# EAGLE design Adafruit VL53L0X (EAGLE 6.6.0)
COMPANY: ADAFRUIT INDUSTRIES; DRAWN: KTOWN; REV: A
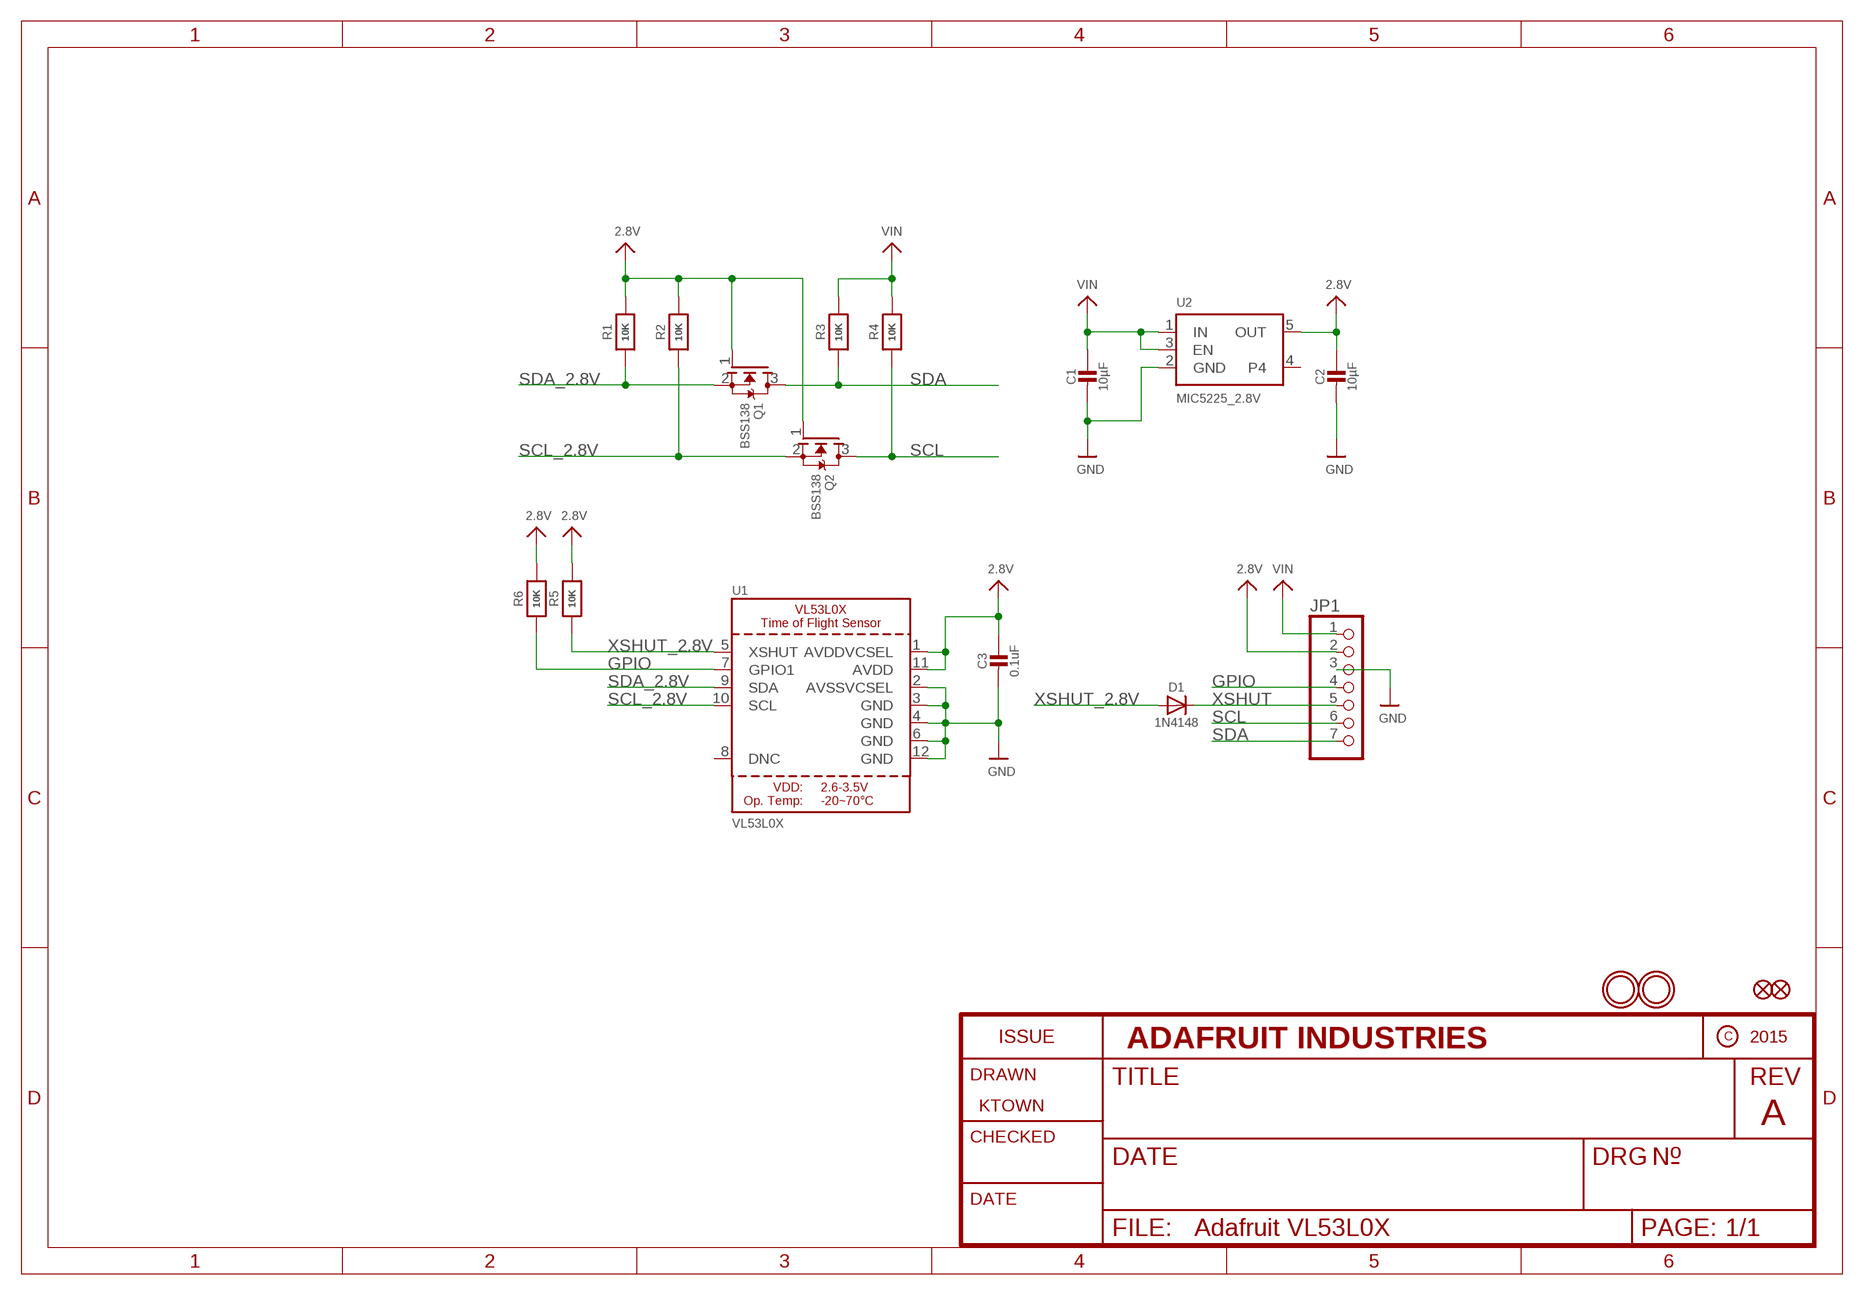
[diagram p0: schematic, sheet 1]

## Parts
C1  10µF  CAP_CERAMIC0805-NOOUTLINE  [0805-NO]
C2  10µF  CAP_CERAMIC0805-NOOUTLINE  [0805-NO]
C3  0.1uF  CAP_CERAMIC0805-NOOUTLINE  [0805-NO]
D1  1N4148  DIODESOD-323  [SOD-323]
FID2  FIDUCIAL""  [FIDUCIAL_1MM]
FID3  FIDUCIAL""  [FIDUCIAL_1MM]
JP1  HEADER-1X770MIL  [1X07_ROUND_70]
Q1  BSS138  MOSFET-NWIDE  [SOT23-WIDE]
Q2  BSS138  MOSFET-NWIDE  [SOT23-WIDE]
R1  10K  RESISTOR0805_NOOUTLINE  [0805-NO]
R2  10K  RESISTOR0805_NOOUTLINE  [0805-NO]
R3  10K  RESISTOR0805_NOOUTLINE  [0805-NO]
R4  10K  RESISTOR0805_NOOUTLINE  [0805-NO]
R5  10K  RESISTOR0805_NOOUTLINE  [0805-NO]
R6  10K  RESISTOR0805_NOOUTLINE  [0805-NO]
U1  VL53L0X  [LGA12_ST]
U2  MIC5225_2.8V  VREG_SOT23-5  [SOT23-5]
U$13  MOUNTINGHOLE2.5  [MOUNTINGHOLE_2.5_PLATED]
U$14  MOUNTINGHOLE2.5  [MOUNTINGHOLE_2.5_PLATED]

## Nets
2.8V: C2.1 C3.1 JP1.2 Q1.1(G) Q2.1(G) R1.2 R2.2 R5.2 R6.2 U1.1(AVDDVCSEL) U1.11(AVDD) U2.5(OUT)
GND: C1.2 C2.2 C3.2 JP1.3 U1.2(AVSSVCSEL) U1.3(GND) U1.4(GND) U1.6(GND) U1.12(GND) U2.2(GND)
GPIO: JP1.4 R6.1 U1.7(GPIO1)
SCL: JP1.6 Q2.3(D) R4.1
SCL_2.8V: Q2.2(S) R2.1 U1.10(SCL)
SDA: JP1.7 Q1.3(D) R3.1
SDA_2.8V: Q1.2(S) R1.1 U1.9(SDA)
VIN: C1.1 JP1.1 R3.2 R4.2 U2.1(IN) U2.3(EN)
XSHUT: D1.C JP1.5
XSHUT_2.8V: D1.A R5.1 U1.5(XSHUT)
Unconnected: U1.8(DNC) U2.4

## Library data of the parts
C1-C3 = microbuilder:CAP_CERAMIC: Ceramic Capacitors For new designs, use the packages preceded by an '_' character since they are more reliable: The following footprints should be used on most boards: _0402 - Standard footprint for regular board layouts _0603 - Standard footprint for regular board layouts _0805 - Standard footprint for regular board layouts _1206 - Standard footprint for regular board layouts For extremely tight-pitch boards where space is at a premium, the following 'micro-pitch' footprints can be used (smaller pads, no silkscreen outline, etc.): _0402MP - Micro-pitch footprint for very dense/compact boards _0603MP - Micro-pitch footprint for very dense/compact boards _0805MP - Micro-pitch footprint for very dense/compact boards _1206MP - Micro-pitch footprint for very dense/compact boards
D1 = microbuilder:DIODE: Diode SMA Model Volts Amps Type Vf Ir Digikey # Notes SSA34-E3 40V 3A Schottky 480mV @ 3A 200uA @ 40V SSA34-E3/61TGITR-ND CDBA120-G 20V 1A Schottky 500mV @ 1A 500uA @ 20V 641-1014-6-ND REEL MBRA210 10V 2A Schottky 350mV @ 2A 700uA @ 10V MBRA210LT3 SOD-123 Model Volts Amps Type Vf Ir Order # Notes BAT54T1G 30V 200mA Schottky 800mV @ 200mA 2uA @ 25V BAT54T1GOSTR-ND B0530W 30V 500mA Schottky 430mV @ 500mA 130uA @ 30V B0530W-FDICT-ND REEL MBR120 20V 1A Schottky 340mV @ 1A MBR120VLSFT1GOSCT-ND SOD-323 Model Volts Amps Type Vf Ir Order # Notes PMEG2005EJ 20V 500mA Schottky 355mV @ 500mA 568-4110-1-ND ZLLS410 10V 570mA Schottky 380mV @ 570mA ZLLS410CT-ND 1N4148WS 75V 150mA Silicon/Simple 1V 1N4148WSFSCT-ND REEL SOD-523 Model Volts Amps Type Vf Ir Order # Notes BAT54XV2 30V 200mA Schottky 0.8V @ 100mA BAT54XV2CT-ND TB751S 30V 30mA Schottky RB751S-40TE61CT-ND SOT23-R/W (R = Solder Paste/Reflow Ovens, W = Hand-Soldering) Model Volts Amps Type Vf Ir Order # Notes BAT54FILM 40V 300mA Schottky 497-7162-1-ND POWERDI-5 Model Volts Amps Type Vf Ir Order # Notes PDS560 60V 5A Schottky 670mV @ 5A 150uA @ 60V PDS560DICT-ND
FID2 FID3 = microbuilder:FIDUCIAL: Fiducial Alignment Points Various fiducial points for machine vision alignment.; BOM: EXCLUDE
JP1 = microbuilder:HEADER-1X7: PIN HEADER
Q1 Q2 = microbuilder:MOSFET-N: N-Channel Mosfet LEGEND VDS: Voltage Drain-Source ID: Drain Current RDS(ON): Drain-Source On-State Resistance VGS(TH): Gate-Source Threshold Voltage CISS: Drain-Source Input Capacitance SOT-23 Name VDS ID RDS(ON) VGS(TH) CISS Order Number 2N7002E 60V 260mA 2.5 Ohm 2.5V @ 250uA 26.7pF @ 25V 2N7002ET1GOSTR-ND BSH103 30V 850mA 400 mOhm 400mV @ 1mA 83pF @ 24V BSH103,235-ND BSS138 60V 320mA 1.6 Ohm 1.5V @ 250uA 50pF @ 10V Mouser: 771-BSS138PW115 DMN2075U-7 20V 4.2A 38 mOhm 1V @ 250 uA 594.3pF @ 10V DMN2075U-7DICT-ND * BSS138 good choice for I2C level-shifting POWERPAK 1212-8 Name VDS ID RDS(ON) VGS(TH) CISS Order Number Si7308DN 60V 6A 58 mOhm 3V @ 250uA 665pF @ 15V SI7308DN-T1-E3CT-ND
R1-R6 = microbuilder:RESISTOR: Resistors For new designs, use the packages preceded by an '_' character since they are more reliable: The following footprints should be used on most boards: _0402 - Standard footprint for regular board layouts _0603 - Standard footprint for regular board layouts _0805 - Standard footprint for regular board layouts _1206 - Standard footprint for regular board layouts For extremely tight-pitch boards where space is at a premium, the following 'micro-pitch' footprints can be used (smaller pads, no silkscreen outline, etc.): _0402MP - Micro-pitch footprint for very dense/compact boards _0603MP - Micro-pitch footprint for very dense/compact boards _0805MP - Micro-pitch footprint for very dense/compact boards _1206MP - Micro-pitch footprint for very dense/compact boards
U1 = microbuilder:VL53L0X: VL53L0X - Laser Time of Flight Sensor (2M range)
U2 = microbuilder:VREG_SOT23-5: SOT23-5 Fixed Voltage Regulators Part Current Out V Out V In V Dropout θJA (°C/W) TJ (°C) Digikey Part No. ADP121 150mA 3.3V 3.4-5.5V 0.09V @ 150mA -- -- ADP121-AUJZ33R7CT-ND ADP121 150mA 3.0V 3.1-5.5V 0.09V @ 150mA -- -- ADP121-AUJZ30R7CT-ND ADP122 300mA 3.3V 3.4-5.5V 0.085V @ 300mA -- -- ADP122AUJZ-3.3-R7CT-ND ADP1712 300mA 3.3V 3.5-5.5V 0.17V @ 300mA -- -- ADP1712AUJZ-3.3-R7TR-ND AP7311 (Low Cost) 150mA 3.3V 3.5-6V 0.15V @ 150mA -- -- AP7311-33WG-7DICT-ND LD39015M18R 150mA 1.8V 1.9V-5.5V 0.08V @ 100mA -- -- 497-6977-1-ND LP2985A-33DBVR 150mA 3.3V 3.3-16V 0.28V @ 150mA 206 150 296-18479-1-ND MCP1824T-3302E/OT 300mA 3.3V 3.5V-6V 0.2V @ 300mA -- -- MCP1824T-3302E/OTCT-ND MIC5205-2.5YM5 TR 150mA 2.5V 2.7-16V 0.165V @ 150mA -- -- 576-1257-2-ND MIC5205-3.0YM5 TR 150mA 3.0V 3.2V-16V 0.165V @ 150mA -- -- 576-1258-2-ND MIC5205-3.3YM5 TR 150mA 3.3V 3.5V-16V 0.165V @ 150mA -- -- 576-1259-2-ND TPS780330220 150mA 3.3V+2.2V 3.6-5.5V 250mV Max -- -- 296-23332-1-ND TDA3663/N1,135 100mA 3.3V 3.5-45V 0.18V @ 50mA -- -- 568-5343-1-ND Max operating temp can be calculated using θJA, TJ (max junction temperature), and power in watts. Set the "Maximum Ambient Temperature" until it reaches TJ ("Max Junction Temperature"), which is the absolute limit for safe use of the regulator: Heat Sink Temperature Calculator <http://www.daycounter.com/Calculators/Heat-Sink-Temperature-Calculator.phtml> For example, With 12V source into a 3.3V LP2985 and a 30mA load, we are dissipating (12V-3.3V) * 0.03A = 0.261W. With a θJA of 206 °C/W, a TJ of 150°C, and 261mW we can safely use the chip without a heat sink up to 75°C (=147.1°C Junction Temperature).
U$13 U$14 = microbuilder:MOUNTINGHOLE: Mounting Hole For #2 screws (0.086"/2.18mm width, 0.094"/2.4mm hole) use 2.5mm; BOM: EXCLUDE

## Board
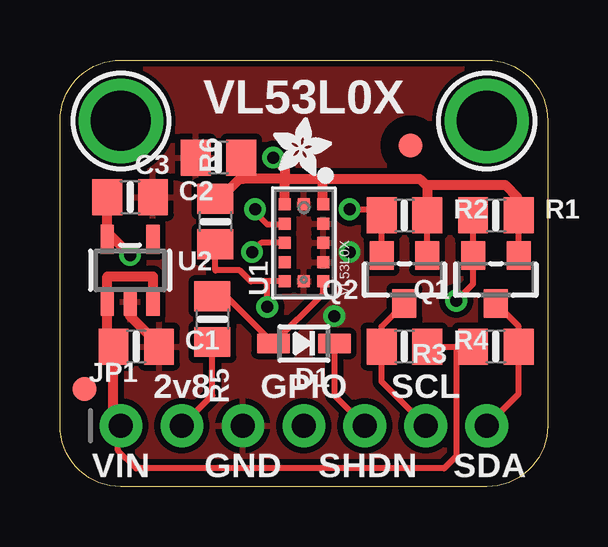
[diagram p1: board, top side]
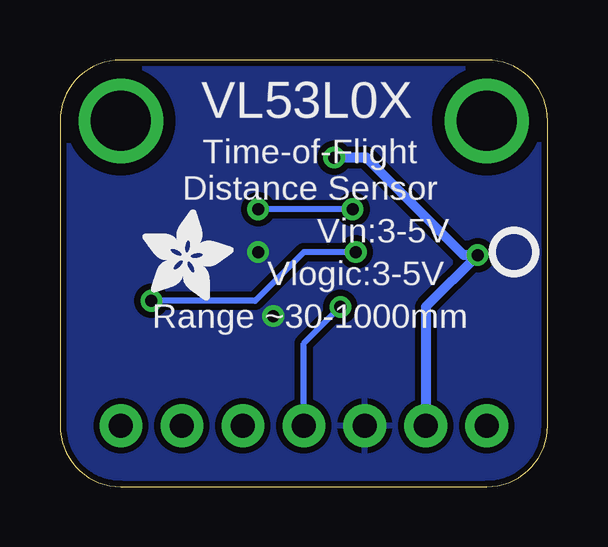
[diagram p2: board, bottom side, seen from below]

Size 20.32 x 17.78 mm. Coordinates in mm from the lower left corner, seen from the top.
Outline: 17.78,0 2.54,0 arc-90 0,2.54 0,15.24 arc-90 2.54,17.78 17.78,17.78 arc-90 20.32,15.24 20.32,2.54 arc-90 17.78,0
Copper layers (1*16): Top 0.035mm / dielectric 1.5mm / Bottom 0.035mm
Design rules "adafruit *": minimum track width 8mil, minimum drill 15.5mil, track to track 8mil, track to pad 8mil, pad to pad 8mil, via to via 8mil, smd to smd 8mil, copper to edge 10mil, drill to drill 8mil, minimum pad ring 10mil, minimum via ring 8mil, stop-mask expansion 2mil, vias tented up to drill 20mil, thermal gap 10mil

### Footprints (pad centres in the part's own frame; a part is rotated, then mirrored left to right if it is on the bottom)
0805-NO = smd 1.24 x 1.5: 1 -0.95,0; 2 0.95,0
SOD-323 = smd 1.35 x 0.8: A 1.27,0; C -1.27,0
FIDUCIAL_1MM = smd 1 x 1: 1 0,0
1X07_ROUND_70 = drill 1 pad 1.778: 1 -7.62,0; 2 -5.08,0; 3 -2.54,0; 4 0,0; 5 2.54,0; 6 5.08,0; 7 7.62,0
SOT23-WIDE = smd 1 x 1.2: 1 -0.95,-1; 2 0.95,-1; 3 0,1
LGA12_ST = smd 0.5 x 0.5: 1 1.6,-0.8; 2 0.8,-0.8; 3 0,-0.8; 4 -0.8,-0.8; 5 -1.6,-0.8; 6 -1.6,0; 7 -1.6,0.8; 8 -0.8,0.8; 9 0,0.8; 10 0.8,0.8; 11 1.6,0.8; 12 1.6,0
SOT23-5 = smd 0.55 x 1.2: 1 -0.95,-1.3; 2 0,-1.3; 3 0.95,-1.3; 4 0.95,1.3; 5 -0.95,1.3
MOUNTINGHOLE_2.5_PLATED = drill 2.5 pad 3.2: P$1 0,0

### Placement (x,y rotation side)
C1  3.17,5.84 0 top
C2  2.92,12.06 0 top
C3  6.6,13.72 180 top
D1  10.16,5.97 180 top
FID2  14.61,14.22 0 top
FID3  1.02,4.06 0 top
JP1  10.16,2.54 0 top
Q1  18.16,8.64 180 top
Q2  14.35,8.64 180 top
R1  18.16,11.3 0 top
R2  14.35,11.3 0 top
R3  18.16,5.84 180 top
R4  14.35,5.84 0 top
R5  6.35,6.99 270 top
R6  6.48,11.05 90 top
U1  10.16,10.16 90 top
U2  2.92,9.02 0 top
U$12  [PCBFEAT-REV-040]  1.4,9.78 0 bottom
U$13  2.54,15.24 0 top
U$14  17.78,15.24 0 top
U$15  [ADAFRUIT_3.5MM]  16.89,7.75 0 bottom
U$18  [ADAFRUIT_2.5MM]  8.89,12.95 0 top

### Tracks (layer width: path | path; a pad name or v marks a point on that pad's centre or on a via)
2.8V  (via drill 0.5)
  Top 0.254: Q1.1 R1.2 | Q2.1 R2.2 | JP1.2 6.35,3.81 R5.2
  Top 0.406: U1.11 9.36,12.66 | 9.36,12.66 9.53,12.83 | 9.53,12.83 10.79,12.83 | 10.79,12.83 10.92,12.7 10.92,11.8 U1.1 | 10.79,12.83 14.99,12.83 15.24,12.57 | 15.24,12.57 15.3,12.51 R2.2 | C3.1 7.55,12.89 | 7.55,12.89 6.6,11.94 6.54,11.94 R6.2 | 9.53,12.83 7.62,12.83 7.55,12.89 | U2.5 1.97,10.47 | 1.97,10.47 C2.1 | 1.97,10.47 1.92,10.41 2.16,10.41 v2.92,9.65 | v8.89,13.72 9.36,13.25 9.36,12.66 | 15.24,12.57 18.54,12.57 19.05,12.06 19.05,11.36 R1.2
  Bottom 0.406: JP1.2 5.08,7.49 v2.92,9.65 3.49,9.65 C3.1 v8.89,13.72
GND  (via drill 0.5)
  Top 0.406: U2.2 2.92,7.11 3.94,6.1 | 3.94,6.1 4.19,5.84 | C1.2 3.94,5.84 3.94,6.1
  other vias: 11.43,7.11 12.06,9.78
  pour Bottom (isolate 0.254): 0,17.78 20.32,17.78 20.32,0 0,0
  pour Top (isolate 0.254): 0,17.78 20.32,17.78 20.32,0 0,0
GPIO  (via drill 0.5)
  Top 0.254: U1.7 8.64,8.56 | R6.1 6.48,9.02 7.49,9.02 7.95,8.56 8.64,8.56 | v8.64,7.49 8.64,8.56
  Bottom 0.254: JP1.4 10.16,5.97 v8.64,7.49
SCL
  Top 0.254: JP1.6 13.4,4.38 R4.1 13.4,6.69 Q2.3
SCL_2.8V  (via drill 0.5)
  Top 0.254: Q2.2 R2.1 13.34,11.37 13.02,11.37 12.83,11.56 v12.06,11.56 | U1.10 9.32,10.92 8.64,10.92 8.13,11.43 v8.13,11.56
  Bottom 0.254: v8.13,11.56 v12.06,11.56
SDA
  Top 0.254: JP1.7 19.11,3.87 R3.1 19.11,6.69 Q1.3
SDA_2.8V  (via drill 0.5)
  Top 0.254: R1.1 Q1.2 17.21,8.45 v16.51,7.75 | U1.9 8.38,10.16 v8,9.78
  Bottom 0.254: v8,9.78 10.16,9.78 12.19,7.75 v16.51,7.75
VIN
  Top 0.254: R3.2 R4.2 16.51,5.84 16.51,1.27 16,0.76 3.17,0.76 2.41,1.52 2.41,2.41 JP1.1
  Top 0.406: JP1.1 2.23,2.85 C1.1 1.97,6.1 U2.1 1.97,8.76 3.87,8.76 U2.3
XSHUT
  Top 0.254: D1.C 11.43,3.81 JP1.5
XSHUT_2.8V
  Top 0.254: R5.1 6.92,7.93 D1.A 10.96,8.04 U1.5

### Text on the board
tPlace: VL53L0X | 2v8 | GPIO | SCL | VIN | GND | SHDN | SDA
bPlace: VL53L0X | Time-of-Flight / Distance Sensor | Vin:3-5V | Vlogic:3-5V | Range ~30-1000mm